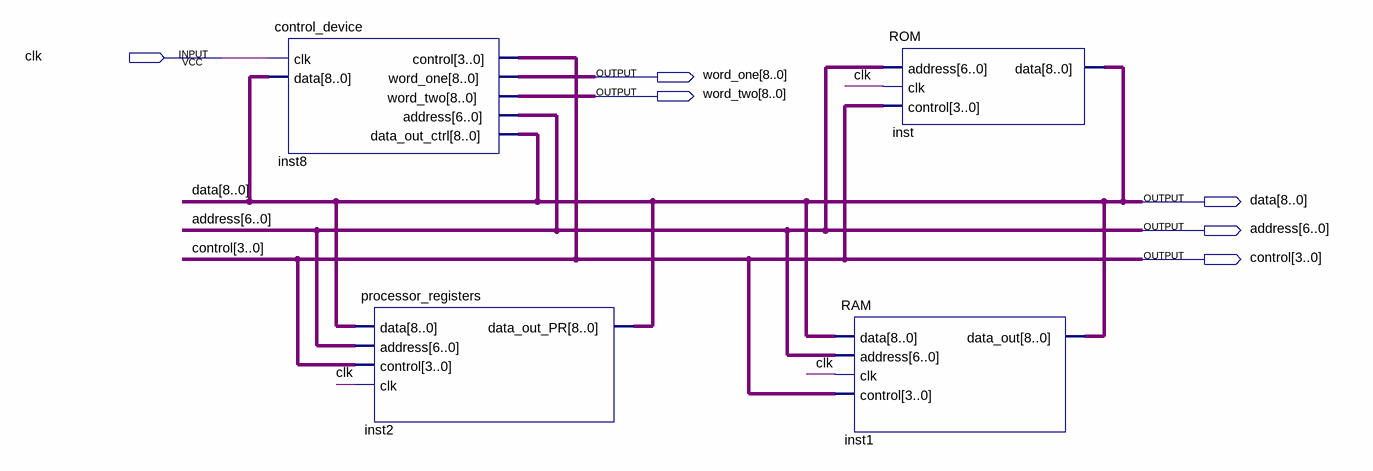
[diagram p0: schematic sheet]
// Quartus schematic main.bdf as structural Verilog: 4 symbols, 6 pins
module main (
  input  clk,
  output [8:0] word_one,
  output [8:0] word_two,
  output [8:0] data,
  output [6:0] address,
  output [3:0] control
);

  control_device inst8 (
    .clk(clk), .data(data), .control(control), .word_one(word_one), .word_two(word_two), .address(address),
    .data_out_ctrl(data));
  processor_registers inst2 (.data(data), .address(address), .control(control), .clk(clk), .data_out_PR(data));
  RAM inst1 (.data(data), .address(address), .clk(clk), .control(control), .data_out(data));
  ROM inst (.address(address), .clk(clk), .control(control), .data(data));
endmodule
